# EAGLE design REV_LIMTER_ARDUINO_NANO (EAGLE 9.1.3)
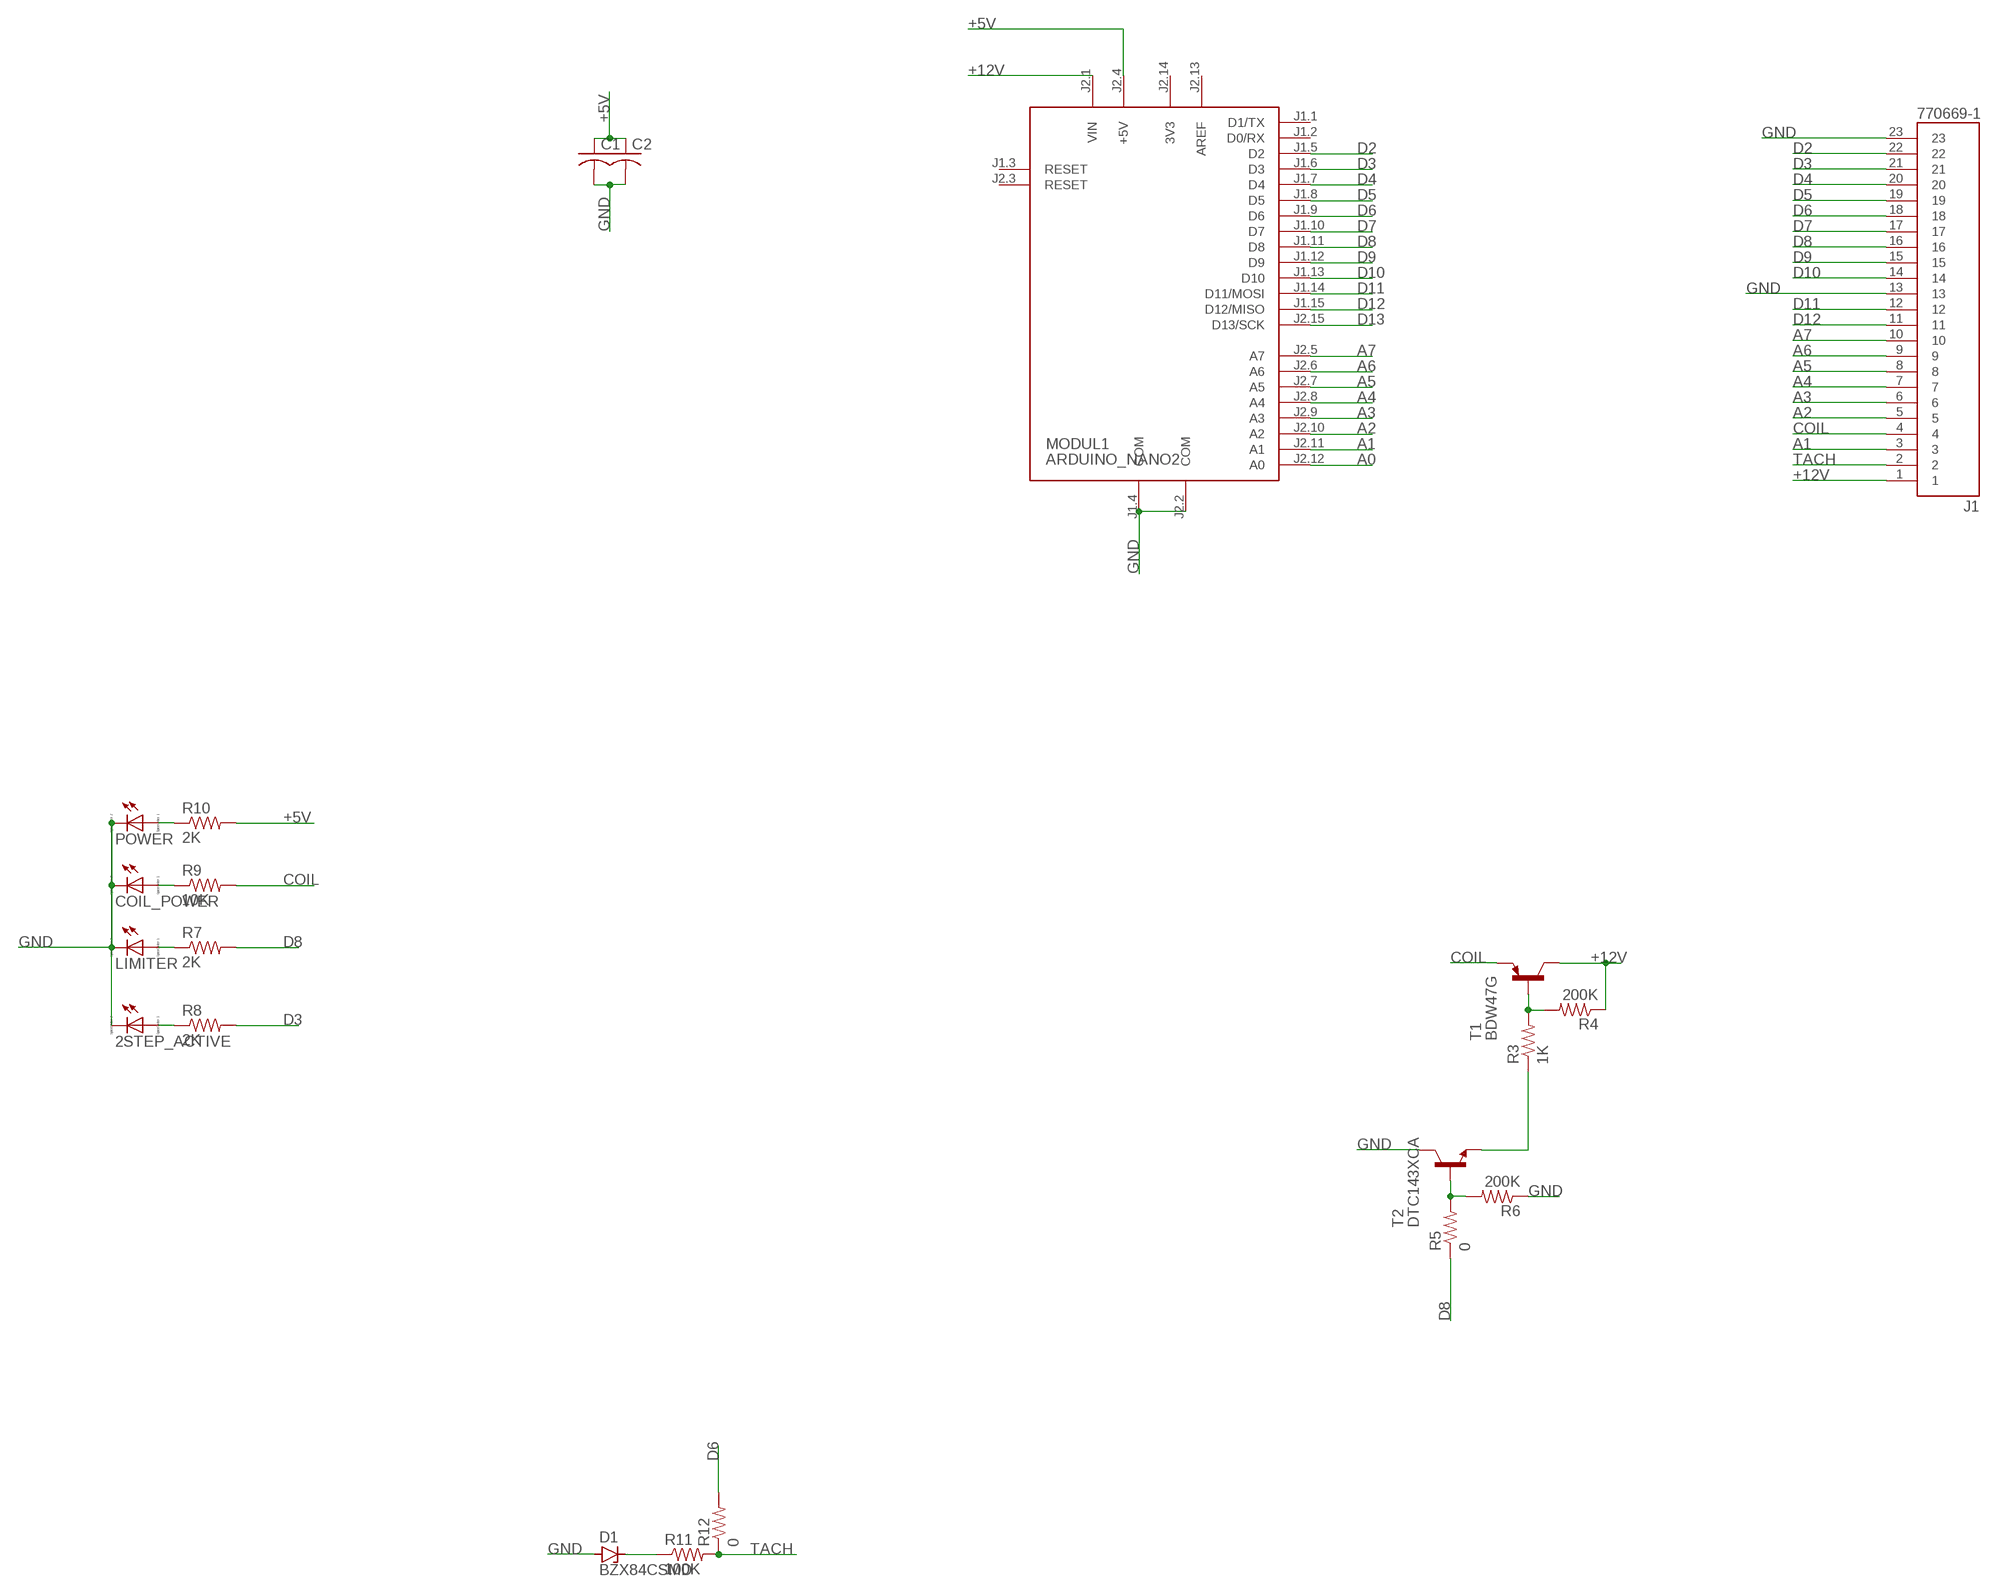
[diagram p0: schematic, sheet 1]

## Parts
2STEP_ACTIVE  LED_E  [LED_1206]
C1  C-USC1206  [C1206]
C2  C-USC1206  [C1206]
COIL_POWER  LED_E  [LED_1206]
D1  BZX84CSMD  [TO236]
J1  770669-1  [TE_770669-1]
LIMITER  LED_E  [LED_1206]
MODUL1  ARDUINO_NANO2  [ARDUINO_NANO2]
POWER  LED_E  [LED_1206]
R3  1K  R-US_M0805  [M0805]
R4  200K  R-US_M0805  [M0805]
R5  0  R-US_M0805  [M0805]
R6  200K  R-US_M0805  [M0805]
R7  2K  R-US_R1206  [R1206]
R8  2K  R-US_R1206  [R1206]
R9  10K  R-US_R1206  [R1206]
R10  2K  R-US_R1206  [R1206]
R11  100K  R-US_R1206  [R1206]
R12  0  R-US_R0805  [R0805]
T1  BDW47G  -PNP-TO220V  [TO220V]
T2  DTC143XCA  BC808-NPN-SOT23-BEC  [SOT23-BEC]

## Nets
+5V: C1.1 C2.1 MODUL1.J2.4(+5V) R10.2
+12V: J1.1 MODUL1.J2.1(VIN) R4.1 T1.2(C)
A0: MODUL1.J2.12(A0)
A1: J1.3 MODUL1.J2.11(A1)
A2: J1.5 MODUL1.J2.10(A2)
A3: J1.6 MODUL1.J2.9(A3)
A4: J1.7 MODUL1.J2.8(A4)
A5: J1.8 MODUL1.J2.7(A5)
A6: J1.9 MODUL1.J2.6(A6)
A7: J1.10 MODUL1.J2.5(A7)
COIL: J1.4 R9.2 T1.3(E)
D2: J1.22 MODUL1.J1.5(D2)
D3: J1.21 MODUL1.J1.6(D3) R8.2
D4: J1.20 MODUL1.J1.7(D4)
D5: J1.19 MODUL1.J1.8(D5)
D6: J1.18 MODUL1.J1.9(D6) R12.2
D7: J1.17 MODUL1.J1.10(D7)
D8: J1.16 MODUL1.J1.11(D8) R5.1 R7.2
D9: J1.15 MODUL1.J1.12(D9)
D10: J1.14 MODUL1.J1.13(D10)
D11: J1.12 MODUL1.J1.14(D11/MOSI)
D12: J1.11 MODUL1.J1.15(D12/MISO)
D13: MODUL1.J2.15(D13/SCK)
GND: 2STEP_ACTIVE.C C1.2 C2.2 COIL_POWER.C D1.A J1.13 J1.23 LIMITER.C MODUL1.J1.4(COM) MODUL1.J2.2(COM) POWER.C R6.1 T2.C
N$1: R3.2 R4.2 T1.1(B)
N$2: R3.1 T2.E
N$3: 2STEP_ACTIVE.A R8.1
N$4: R5.2 R6.2 T2.B
N$5: LIMITER.A R7.1
N$6: COIL_POWER.A R9.1
N$7: POWER.A R10.1
N$8: D1.C R11.1
TACH: J1.2 R11.2 R12.1
Unconnected: MODUL1.J1.1(D1/TX) MODUL1.J1.2(D0/RX) MODUL1.J1.3(RESET) MODUL1.J2.3(RESET)

## Power pins joined to a net without a drawn wire
3V3: MODUL1.J2.14(3V3)
AREF: MODUL1.J2.13(AREF)

## Library data of the parts
2STEP_ACTIVE COIL_POWER LIMITER POWER = eagle-ltspice:LED_E: LED Source: http://www.osram.convergy.de Source: www.luxeon.com Source: www.kingbright.com; SPICEMODEL: NONE; SPICEPREFIX: D; SPICETYPE: diode
C1 C2 = resistor:C-US: CAPACITOR, American symbol
D1 = diode:BZX84CSMD: Z DIODE
J1 = 770669-1:770669-1: CONN HEADER 23POS R/A TIN BLK; AVAILABILITY: Unavailable; COMMENT: 770669-1; DESCRIPTION: AMPSEAL 23 Position Three Row Right Angle Snap Mount Pin Header; EU_ROHS_COMPLIANCE: Compliant; MF: TE Connectivity; MP: 770669-1; PACKAGE: None; PRICE: None; TE_PURCHASE_URL: https://www.te.com/usa-en/product-770669-1.html?te_bu=Cor&te_type=disp&te_campaign=seda_glo_cor-seda-global-disp-prtnr-fy19-seda-model-bom-cta_sma-317_1&elqCampaignId=32493
MODUL1 = arduino:ARDUINO_NANO2: Arduino Nano2 Auto generated by modulcreator.ulp \;; ANZAHL: 2; MODUL: TRUE; STECKX0: -76200; STECKX1: 76200; STECKY0: 177800; STECKY1: 177800
R3-R12 = rcl:R-US_: RESISTOR, American symbol; SPICEPREFIX: R
T1 = transistor-neu-to92:*-PNP-: PNP Transistror
T2 = transistor:*-NPN-: NPN Transistror BF959 corrected 2008.03.06

## Board
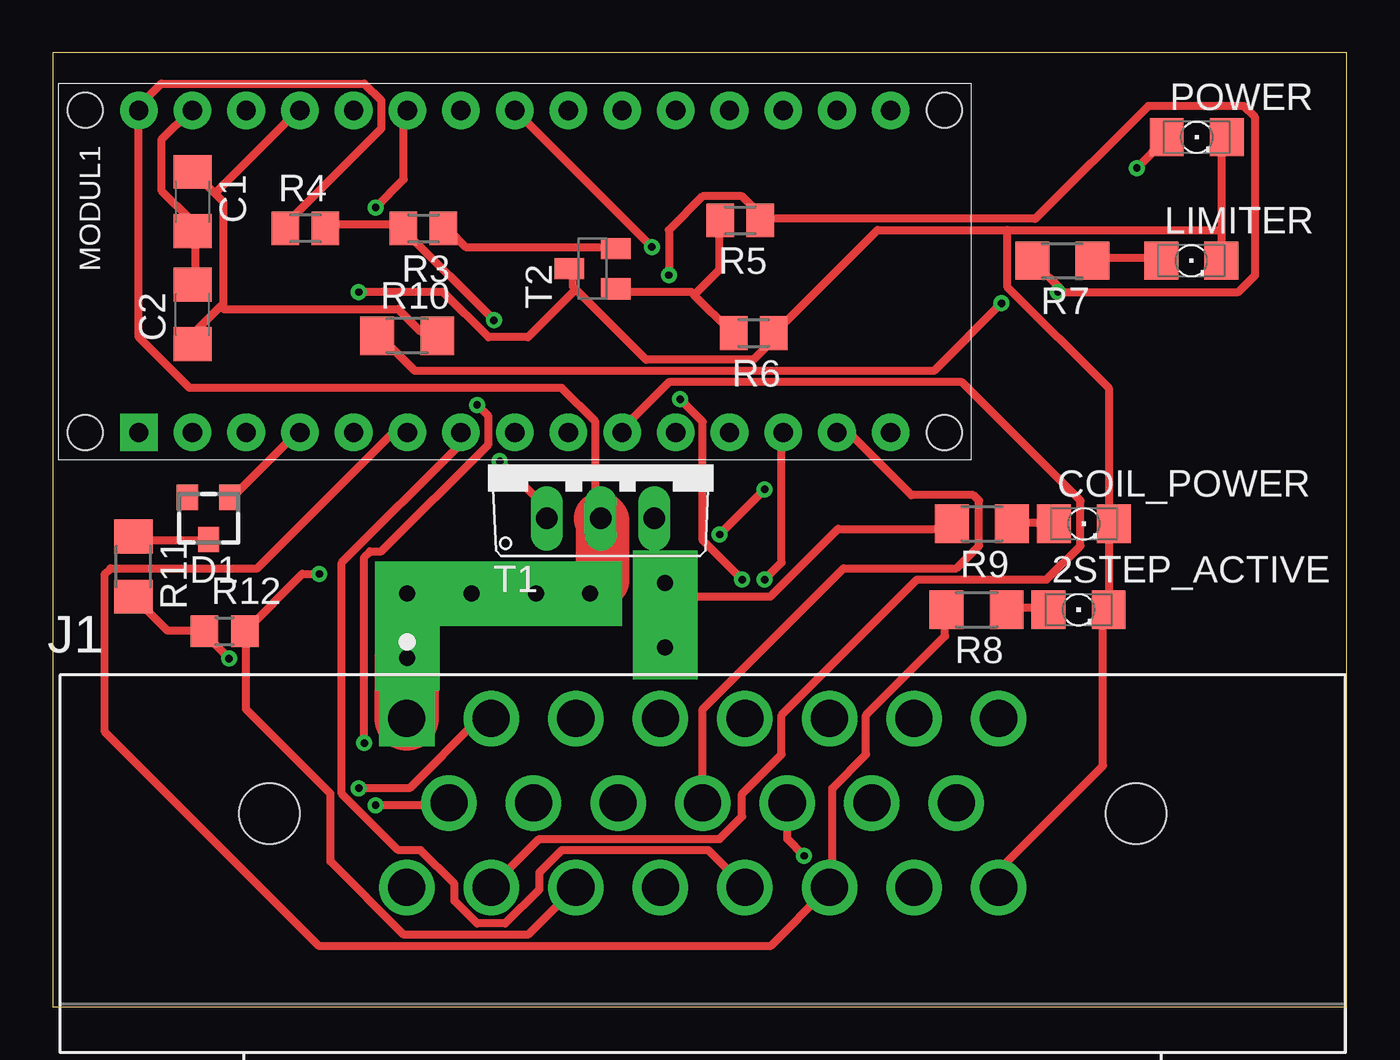
[diagram p1: board, top side]
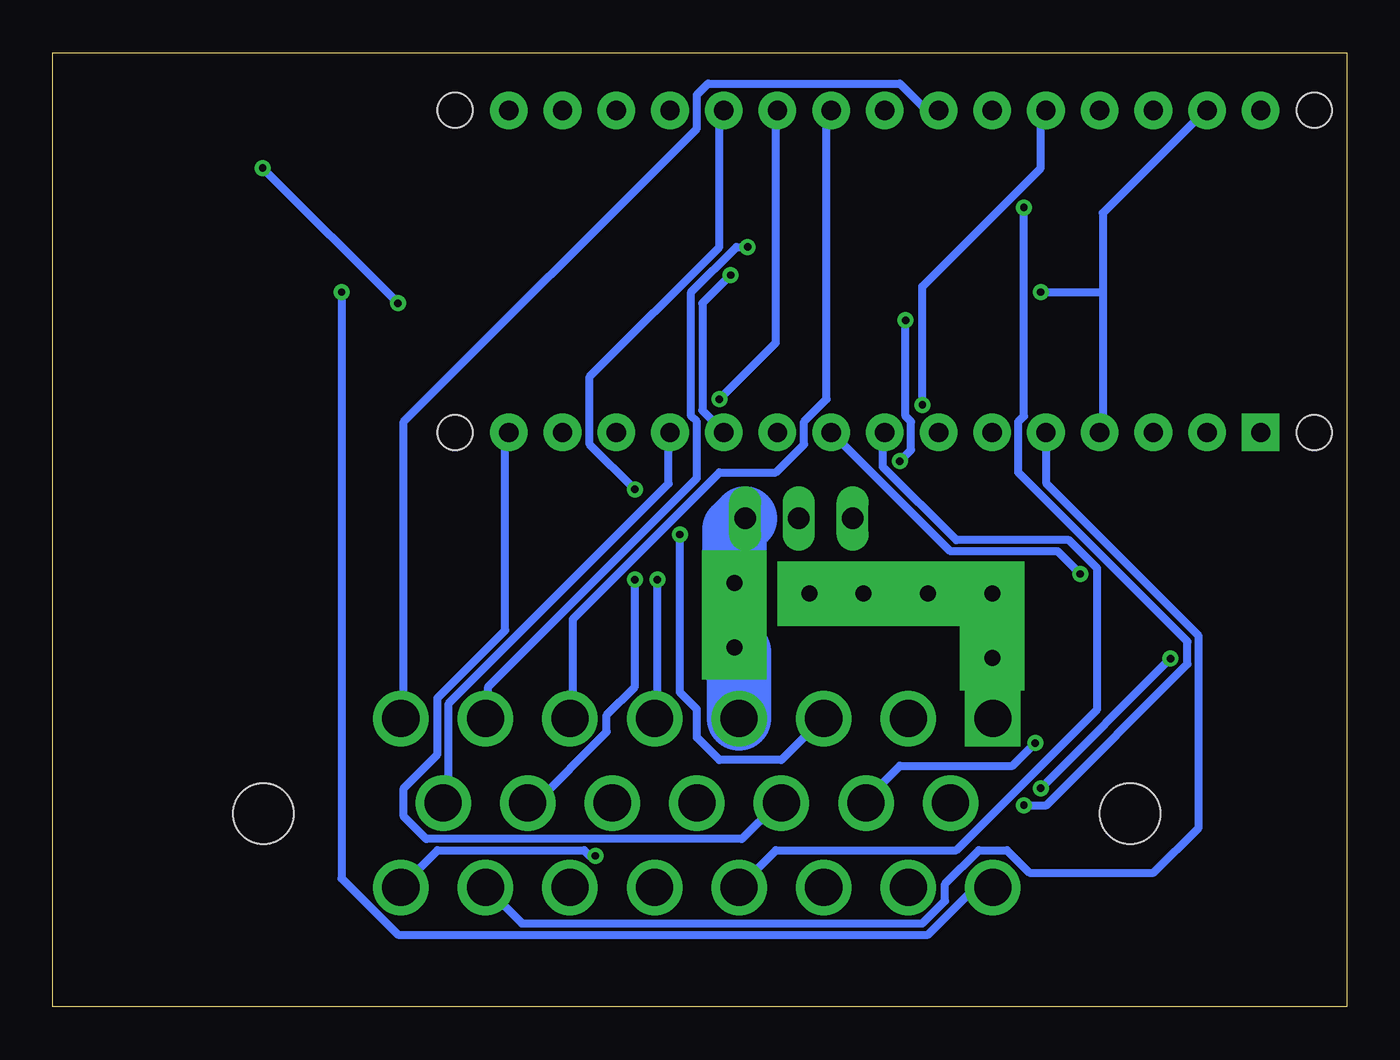
[diagram p2: board, bottom side, seen from below]

Size 61.19 x 45.14 mm. Coordinates in mm from the lower left corner, seen from the top.
Outline: 0,0 61.19,0 61.19,45.14 0,45.14 0,0
Copper layers (1*16): Top 0.035mm / dielectric 1.5mm / Bottom 0.035mm
Design rules "default *": minimum track width 15mil, minimum drill 0.35mm, track to track 6mil, track to pad 6mil, pad to pad 6mil, via to via 6mil, smd to smd 6mil, copper to edge 40mil, drill to drill 6mil, minimum pad ring 10mil, minimum via ring 8mil, stop-mask expansion 4mil, vias tented up to drill 0mil, thermal gap 10mil

### Footprints (pad centres in the part's own frame; a part is rotated, then mirrored left to right if it is on the bottom)
LED_1206 = smd 1.6 x 1.803: A -1.422,0; C 1.422,0
C1206 = smd 1.6 x 1.8: 1 -1.4,0; 2 1.4,0
TO236 = smd 1 x 1.2: A -1,-1; C 0,1; NC 1,-1
TE_770669-1 = drill 1.75 square: 1 -14,4 | drill 1.75: 2 -10,4; 3 -6,4; 4 -2,4; 5 2,4; 6 6,4; 7 10,4; 8 14,4; 9 -12,0; 10 -8,0; 11 -4,0; 12 0,0; 13 4,0; 14 8,0; 15 12,0; 16 -14,-4; 17 -10,-4; 18 -6,-4; 19 -2,-4; 20 2,-4; 21 6,-4; 22 10,-4; 23 14,-4 | hole 2.85: -20.5,-0.5; 20.5,-0.5
ARDUINO_NANO2 = drill 0.914 pad 1.778 square: J1.1 -7.62,17.78 | drill 0.914 pad 1.778: J1.2 -7.62,15.24; J1.3 -7.62,12.7; J1.4 -7.62,10.16; J1.5 -7.62,7.62; J1.6 -7.62,5.08; J1.7 -7.62,2.54; J1.8 -7.62,0; J1.9 -7.62,-2.54; J1.10 -7.62,-5.08; J1.11 -7.62,-7.62; J1.12 -7.62,-10.16; J1.13 -7.62,-12.7; J1.14 -7.62,-15.24; J1.15 -7.62,-17.78; J2.1 7.62,17.78; J2.2 7.62,15.24; J2.3 7.62,12.7; J2.4 7.62,10.16; J2.5 7.62,7.62; J2.6 7.62,5.08; J2.7 7.62,2.54; J2.8 7.62,0; J2.9 7.62,-2.54; J2.10 7.62,-5.08; J2.11 7.62,-7.62; J2.12 7.62,-10.16; J2.13 7.62,-12.7; J2.14 7.62,-15.24; J2.15 7.62,-17.78 | hole 1.651: -7.62,-20.32; 7.62,-20.32; 7.62,20.32; -7.62,20.32
M0805 = smd 1.3 x 1.6: 1 -0.95,0; 2 0.95,0
R1206 = smd 1.6 x 1.803: 1 -1.422,0; 2 1.422,0
R0805 = smd 1.3 x 1.5: 1 -0.95,0; 2 0.95,0
TO220V = drill 1.016 long: 1 -2.54,-2.54; 2 0,-2.54; 3 2.54,-2.54
SOT23-BEC = smd 1 x 1.4: B -0.95,-1.1; C 0,1.1; E 0.95,-1.1

### Placement (x,y rotation side)
2STEP_ACTIVE  48.51,18.8 0 top
C1  6.6,38.1 270 top
C2  6.6,32.77 90 top
COIL_POWER  48.77,22.86 0 top
D1  7.37,23.11 180 top
J1  30.73,9.65 0 top
LIMITER  53.85,35.31 0 top
MODUL1  21.84,34.8 90 top
POWER  54.1,41.15 0 top
R3  17.53,36.83 180 top
R4  11.94,36.83 0 top
R5  32.51,37.21 180 top
R6  33.15,31.88 180 top
R7  47.75,35.31 180 top
R8  43.69,18.8 180 top
R9  43.94,22.86 180 top
R10  16.76,31.75 0 top
R11  3.81,20.83 270 top
R12  8.13,17.78 0 top
T1  25.91,25.65 0 top
T2  25.53,34.92 90 top

### Tracks (layer width: path | path; a pad name or v marks a point on that pad's centre or on a via)
+5V
  Top 0.381: 7.93,33.15 8.06,33.29 8.06,38.09 7.66,38.49 | 7.93,33.15 6.73,31.95 6.73,31.42 C2.1 | 7.66,38.49 6.73,39.42 C1.1 | R10.2 17.93,31.95 17.4,31.95 16.33,33.02 8.06,33.02 7.93,33.15 | MODUL1.J2.4 11.53,42.36 7.8,38.62 7.66,38.49
+12V  (via drill 0.76 pad 3.05)
  Top 0.381: R4.1 11,37.02 15.53,41.55 15.53,42.89 14.73,43.69 5.13,43.69 4.06,42.62 MODUL1.J2.1 4.06,42.36 4.06,31.69 6.46,29.29 24.07,29.29 25.67,27.69 25.67,23.66 T1.2
  Top 2.54: v25.4,19.56 26.01,20.17 26.01,23.01 T1.2
  Top 3.048: J1.1 16.73,16.48 v16.76,16.51 v16.76,19.56 v19.81,19.56 v22.86,19.56 v25.4,19.56
A1  (via drill 0.35)
  Top 0.381: v31.53,22.35 v33.67,24.49
  Bottom 0.381: v33.67,24.49 35.8,26.62 35.8,29.82 29.67,35.95 29.67,42.36 MODUL1.J2.11 | v31.53,22.35 31.53,14.88 30.73,14.08 30.73,12.75 29.67,11.68 26.73,11.68 24.87,13.55 J1.3
A2  (via drill 0.35)
  Top 0.381: v29.67,28.75 30.73,27.69 30.73,22.09 v32.6,20.22
  Bottom 0.381: v29.67,28.75 27,31.42 27,42.36 MODUL1.J2.10 | v32.6,20.22 32.6,13.82 J1.5
A3
  Bottom 0.381: MODUL1.J2.9 24.6,42.36 24.6,28.75 25.67,27.69 25.67,26.62 27,25.29 29.67,25.29 36.6,18.35 36.6,13.82 J1.6
A4  (via drill 0.35)
  Top 0.381: v28.33,35.95 21.93,42.36 MODUL1.J2.8
  Bottom 0.381: v28.33,35.95 28.87,35.95 31,33.82 31,27.95 30.73,27.69 30.73,25.02 40.6,15.15 40.6,13.82 J1.7
A5
  Bottom 0.381: MODUL1.J2.7 19.53,42.62 20.07,42.62 21.13,43.69 30.2,43.69 30.73,43.16 30.73,41.55 44.6,27.69 44.6,13.82 J1.8
A6  (via drill 0.35)
  Top 0.381: v15.27,37.82 16.6,39.15 16.6,42.36 MODUL1.J2.6 | v15.27,9.55 18.73,9.55 J1.9
  Bottom 0.381: v15.27,37.82 15.27,27.95 15.53,27.69 15.53,25.29 7.53,17.29 7.53,16.22 14.2,9.55 v15.27,9.55
A7  (via drill 0.35)
  Top 0.381: v20.07,28.49 20.6,27.95 20.6,26.62 15.53,21.55 15,21.55 14.73,21.29 v14.73,12.48
  Bottom 0.381: v20.07,28.49 20.07,34.09 14.46,39.69 14.46,42.36 MODUL1.J2.5 | v14.73,12.48 15.8,11.42 21.13,11.42 22.73,9.82 J1.10
COIL  (via drill 0.76 pad 3.05)
  Top 0.381: R9.2 42.47,22.62 37.13,22.62 33.93,19.42 29.67,19.42 29.13,19.95 v28.96,20.07
  Bottom 3.048: J1.4 28.73,16.8 v28.96,17.02 v28.96,20.07 28.96,22.61 T1.3
D2
  Bottom 0.381: MODUL1.J1.5 14.2,27.15 14.2,24.75 7,17.55 7,8.48 9.13,6.35 15,6.35 16.07,7.42 17.4,7.42 19,5.82 19,5.02 20.07,3.95 39,3.95 40.6,5.55 J1.22
D3
  Top 0.381: R8.2 42.2,18.62 42.2,17.55 38.47,13.82 38.47,11.95 36.87,10.35 36.87,5.82 J1.21 36.6,5.55 33.93,2.88 12.6,2.88 2.46,13.02 2.46,20.48 2.73,20.75 9.66,20.75 16.07,27.15 16.6,27.15 MODUL1.J1.6
D4
  Top 0.381: MODUL1.J1.7 19.27,27.15 19.27,26.62 13.67,21.02 13.67,10.08 16.33,7.42 17.4,7.42 19,5.82 19,5.02 20.07,3.95 21.4,3.95 23,5.55 23,6.35 24.07,7.42 31,7.42 32.6,5.82 J1.20
D5
  Bottom 0.381: MODUL1.J1.8 21.93,27.15 21.93,25.55 18.47,22.09 13.13,22.09 11.8,20.75 11.8,14.08 18.47,7.42 27,7.42 28.6,5.82 J1.19
D6  (via drill 0.35)
  Top 0.381: J1.18 24.6,5.55 22.47,3.42 16.6,3.42 13.13,6.88 13.13,10.08 9.13,14.08 9.13,17.55 R12.2 9.13,17.82 11.8,20.48 v12.6,20.48
  Bottom 0.381: v12.6,20.48 13.67,21.55 18.73,21.55 24.33,27.15 MODUL1.J1.9
D7
  Top 0.381: MODUL1.J1.10 27,27.42 29.13,29.55 43,29.55 48.6,23.95 48.6,21.82 47,20.22 40.87,20.22 34.47,13.82 34.47,11.95 32.6,10.08 32.6,9.02 31.53,7.95 23,7.95 20.87,5.82 J1.17
D8  (via drill 0.35)
  Top 0.381: 33.67,37.29 46.47,37.29 51.8,42.62 56.34,42.62 56.87,42.09 56.87,34.62 56.07,33.82 47.8,33.82 47.67,33.95 | 47.67,33.95 46.47,35.15 R7.2 | 33.67,37.29 R5.1 33.67,37.29 | v29.13,34.62 29.13,36.75 30.73,38.35 32.6,38.35 33.67,37.29 | v47.54,33.82 47.67,33.95
  Bottom 0.381: v29.13,34.62 30.47,33.29 30.47,28.22 29.67,27.42 MODUL1.J1.11 | v47.54,33.82 47.54,6.08 44.87,3.42 19.8,3.42 17.67,5.55 16.87,5.55 J1.16
D9
  Bottom 0.381: MODUL1.J1.12 32.07,27.15 32.07,24.75 42.47,14.35 42.47,9.82 J1.15
D10  (via drill 0.35)
  Top 0.381: v33.67,20.22 34.47,21.02 34.47,27.15 MODUL1.J1.13
  Bottom 0.381: v33.67,20.22 33.67,15.15 35,13.82 35,13.02 38.47,9.55 J1.14
D11
  Top 0.381: MODUL1.J1.14 37.13,27.15 37.67,27.15 40.6,24.22 43.54,24.22 43.8,23.95 43.8,21.82 42.74,20.75 37.4,20.75 30.73,14.08 30.73,9.82 J1.12
D12
  Bottom 0.381: MODUL1.J1.15 39.8,27.15 39.8,17.82 43,14.62 43,11.95 44.6,10.35 44.6,9.02 43.54,7.95 28.6,7.95 27,9.55 J1.11
GND  (via drill 0.35)
  Top 0.381: J1.23 44.87,5.82 44.87,6.62 49.67,11.42 49.67,18.62 2STEP_ACTIVE.C 49.94,18.89 49.94,22.62 COIL_POWER.C 49.94,22.89 49.94,29.29 45.14,34.09 45.14,36.75 | v35.53,7.15 34.73,7.95 34.73,9.55 J1.13 | D1.A 8.6,24.22 11.53,27.15 MODUL1.J1.4 | C2.2 6.73,34.35 6.73,36.49 C1.2 6.46,36.75 6.46,37.29 5.13,38.62 5.13,41.02 6.46,42.36 MODUL1.J2.2 | 55.27,36.75 55.27,41.02 POWER.C | 55.27,36.75 55.27,35.42 LIMITER.C | 24.73,33.95 28.07,30.62 33.13,30.62 34.2,31.69 R6.1 34.2,31.95 39,36.75 45.14,36.75 | 24.73,33.95 24.6,34.09 24.6,34.89 T2.C | 45.14,36.75 55.27,36.75 | v14.46,33.82 18.47,33.82 20.6,31.69 22.47,31.69 24.6,33.82 24.73,33.95
  Bottom 0.381: v35.53,7.15 35.8,7.15 36.07,7.42 43,7.42 44.6,5.82 J1.23 | 11.53,33.82 11.53,37.55 6.73,42.36 MODUL1.J2.2 | 11.53,33.82 11.53,27.42 MODUL1.J1.4 | v14.46,33.82 11.53,33.82
N$1  (via drill 0.35)
  Top 0.381: R4.2 13.13,37.02 16.33,37.02 R3.2 16.6,36.75 v20.87,32.49 | v21.13,25.82 22.74,24.21 T1.1
  Bottom 0.381: v20.87,32.49 20.87,27.95 20.6,27.69 20.6,26.35 v21.13,25.82
N$2
  Top 0.381: T2.E 26.47,35.95 19.53,35.95 18.73,36.75 R3.1
N$3
  Top 0.381: R8.1 45.14,18.89 47,18.89 2STEP_ACTIVE.A
N$4
  Top 0.381: 30.33,33.69 32.07,31.95 R6.2 | 30.33,33.69 30.2,33.82 26.73,33.82 T2.B | R5.2 31.53,37.02 31.53,34.89 30.47,33.82 30.33,33.69
N$5
  Top 0.381: R7.1 49.4,35.42 52.34,35.42 LIMITER.A
N$6
  Top 0.381: R9.1 45.4,22.89 47.27,22.89 COIL_POWER.A
N$7  (via drill 0.35)
  Top 0.381: v44.87,33.29 41.67,30.09 17.13,30.09 15.53,31.69 R10.1 | v51.27,39.69 52.6,41.02 POWER.A
  Bottom 0.381: v51.27,39.69 v44.87,33.29
N$8
  Top 0.381: D1.C 7.26,22.09 4.06,22.09 R11.1
TACH  (via drill 0.35)
  Top 0.381: R11.2 4.06,19.15 5.4,17.82 7,17.82 R12.1 7.26,17.55 v8.33,16.48 | v14.46,10.35 16.87,10.35 20.07,13.55 20.6,13.55 J1.2
  Bottom 0.381: v14.46,10.35 v8.33,16.48